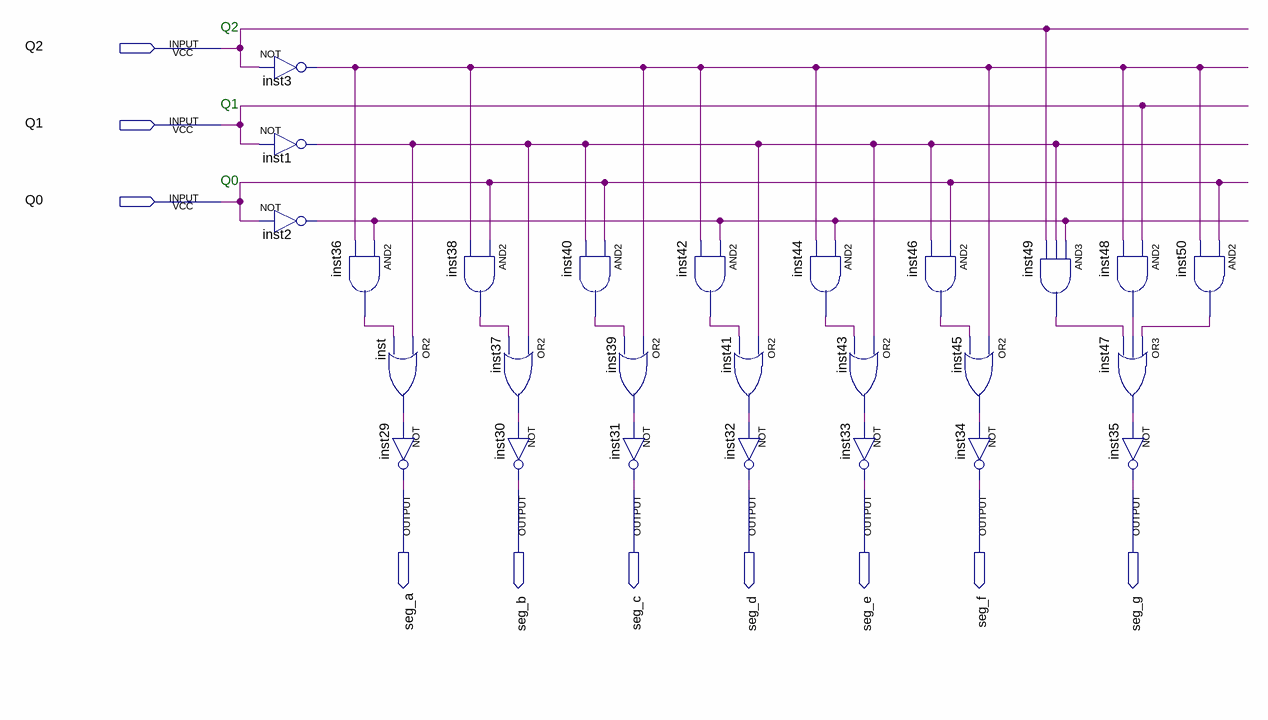
[diagram p0: schematic sheet]
// Quartus schematic Timer_7-seg.bdf as structural Verilog: 26 symbols, 10 pins
module \Timer_7-seg  (
  input  Q2,
  input  Q1,
  input  Q0,
  output seg_a,
  output seg_b,
  output seg_c,
  output seg_d,
  output seg_e,
  output seg_f,
  output seg_g
);

  wire inst1_out, inst2_out, inst3_out, inst36_out, inst37_out, inst38_out, inst39_out, inst40_out,
       inst41_out, inst42_out, inst43_out, inst44_out, inst45_out, inst46_out, inst47_out, inst48_out,
       inst49_out, inst50_out, inst_out;

  not inst3 (inst3_out, Q2);
  not inst1 (inst1_out, Q1);
  not inst2 (inst2_out, Q0);
  and inst36 (inst36_out, inst2_out, inst3_out);
  or inst (inst_out, inst1_out, inst36_out);
  not inst29 (seg_a, inst_out);
  and inst38 (inst38_out, Q0, inst3_out);
  or inst37 (inst37_out, inst1_out, inst38_out);
  and inst40 (inst40_out, Q0, inst1_out);
  not inst30 (seg_b, inst37_out);
  or inst39 (inst39_out, inst3_out, inst40_out);
  not inst31 (seg_c, inst39_out);
  and inst42 (inst42_out, inst2_out, inst3_out);
  or inst41 (inst41_out, inst1_out, inst42_out);
  and inst44 (inst44_out, inst2_out, inst3_out);
  not inst32 (seg_d, inst41_out);
  or inst43 (inst43_out, inst1_out, inst44_out);
  not inst33 (seg_e, inst43_out);
  and inst46 (inst46_out, Q0, inst1_out);
  or inst45 (inst45_out, inst3_out, inst46_out);
  and inst49 (inst49_out, inst2_out, inst1_out, Q2);
  not inst34 (seg_f, inst45_out);
  and inst48 (inst48_out, Q1, inst3_out);
  or inst47 (inst47_out, inst50_out, inst48_out, inst49_out);
  and inst50 (inst50_out, Q0, inst3_out);
  not inst35 (seg_g, inst47_out);

  // Notes on the sheet:
  //   Q2
  //   Q1
  //   Q0
endmodule
